# EAGLE schematic LaserBoardv1.0 (EAGLE 9.1.3)
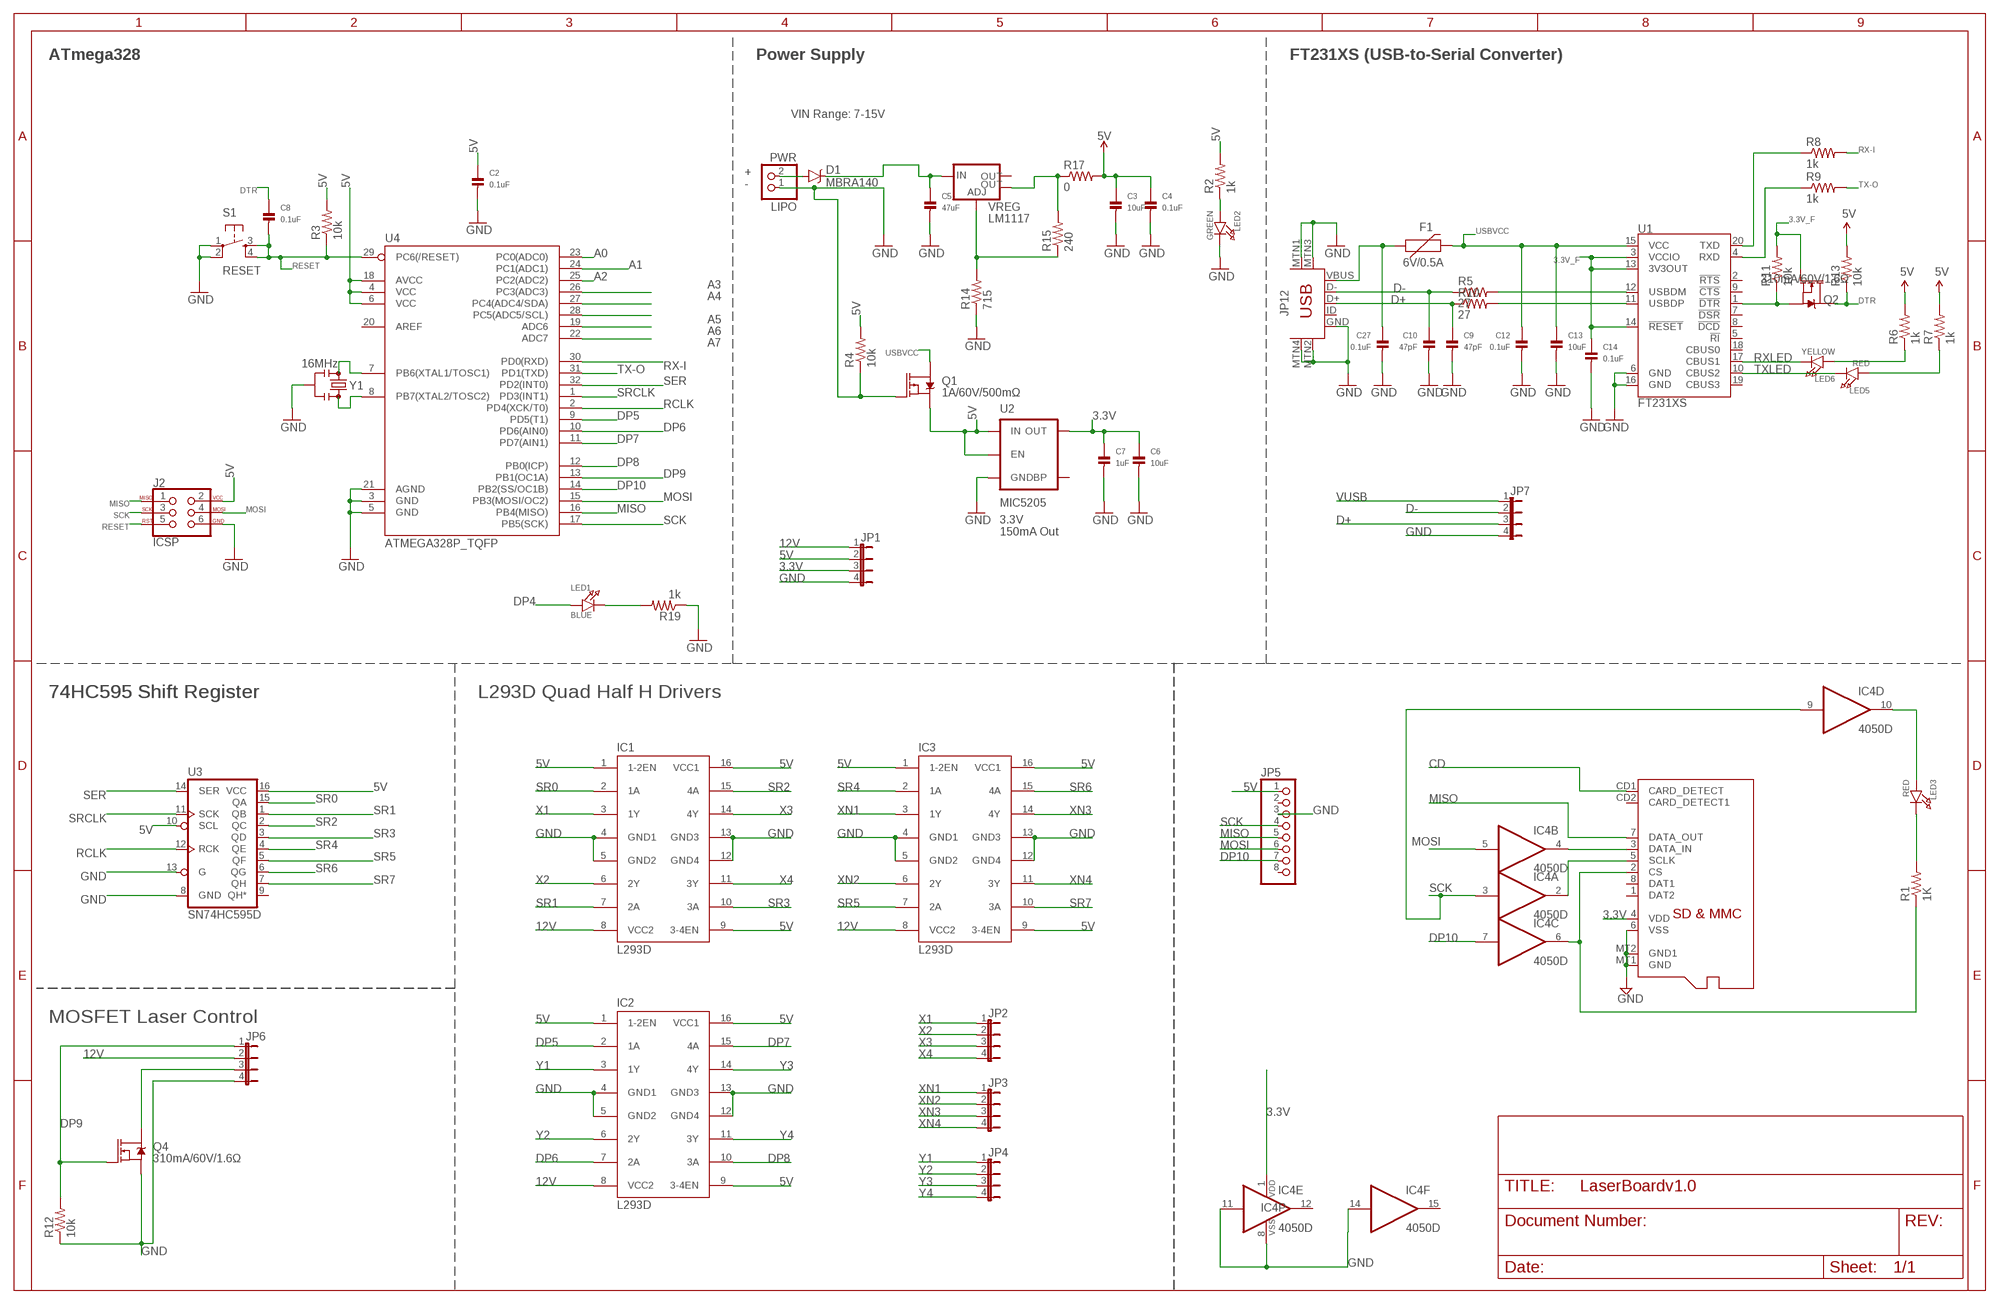
[diagram p0: schematic, sheet 1]

## Parts
C2  0.1uF  CAP_CERAMIC0805  [0805]
C3  10uF  CAP_CERAMIC0805  [0805]
C4  0.1uF  CAP_CERAMIC0805  [0805]
C5  47uF  CAP_CERAMIC0805  [0805]
C6  10uF  CAP_CERAMIC0805  [0805]
C7  1uF  CAP_CERAMIC0805  [0805]
C8  0.1uF  CAP_CERAMIC0805  [0805]
C9  47pF  CAP_CERAMIC0805  [0805]
C10  47pF  CAP_CERAMIC0805  [0805]
C12  0.1uF  CAP_CERAMIC0805  [0805]
C13  10uF  CAP_CERAMIC0805  [0805]
C14  0.1uF  CAP_CERAMIC0805  [0805]
C27  0.1uF  CAP_CERAMIC0805  [0805]
D1  MBRA140  [SMA-DIODE]
F1  6V/0.5A  PTC-HALF_AMP  [1206]
IC1  L293D  [DIL16]
IC2  L293D  [DIL16]
IC3  L293D  [DIL16]
IC4  4050D  [SO16]
J2  ICSP  AVR_SPI_PROG_3X2PTH  [2X3]
JP1  JP4E  [JP4]
JP2  JP4E  [JP4]
JP3  JP4E  [JP4]
JP4  JP4E  [JP4]
JP5  PINHD-1X8BIG  [1X08-BIG]
JP6  JP4E  [JP4]
JP7  JP4E  [JP4]
JP12  USB-MINIB-5PIN  [USB-MINIB]
LED1  BLUE  LED0805  [CHIPLED_0805]
LED2  GREEN  LED0805  [CHIPLED_0805]
LED3  RED  LED0805  [CHIPLED_0805]
LED5  RED  LED0805  [CHIPLED_0805]
LED6  YELLOW  LED0805  [CHIPLED_0805]
PWR  LIPO  JST_2PIN-THM-RA  [JST-PH-2-THM-RA]
Q1  1A/60V/500mΩ  MOSFET-PCH-ZXMP6A13F  [SOT23-3]
Q2  310mA/60V/1.6Ω  MOSFET-NCH-2N7002PW  [SOT323]
Q4  310mA/60V/1.6Ω  MOSFET-NCH-2N7002PW  [SOT323]
R1  1K  R-US_R0805  [R0805]
R2  1k  R-US_R0805  [R0805]
R3  10k  R-US_R0805  [R0805]
R4  10k  R-US_R0805  [R0805]
R5  27  R-US_R0805  [R0805]
R6  1k  R-US_R0805  [R0805]
R7  1k  R-US_R0805  [R0805]
R8  1k  R-US_R0805  [R0805]
R9  1k  R-US_R0805  [R0805]
R10  27  R-US_R0805  [R0805]
R11  10k  R-US_R0805  [R0805]
R12  10k  R-US_R0805  [R0805]
R13  10k  R-US_R0805  [R0805]
R14  715  R-US_R0805  [R0805]
R15  240  R-US_R0805  [R0805]
R17  0  R-US_R0805  [R0805]
R19  1k  R-US_R0805  [R0805]
S1  RESET  SWITCH_SPST_4_PINRECT  [TACTILE_SWITCH_SMD_4.6X2.8MM]
U1  FT231XS  [SSOP20_L]
U2  MIC5205  MIC52053.3V  [SOT23-5]
U3  SN74HC595D  74HC595D  [SO16]
U4  ATMEGA328P_TQFP  [TQFP32-08]
VREG  LM1117  V_REG_LM1117SOT223  [SOT223]
X1  MICROSD  [MICROSD]
Y1  16MHz  RESONATOR-16MHZSMD_3.2X1.3  [RESONATOR-SMD-3.2X1.3]

## Nets
3.3V: C6.1 C7.1 IC4.1(P:VDD) JP1.3 U2.5(OUT) X1.4(VDD)
3.3V_F: C14.1 Q2.1(G) R11.2 U1.3(VCCIO) U1.13(3V3OUT) U1.14(!RESET)
5V: C2.1 C3.1 C4.1 IC1.1(1-2EN) IC1.9(3-4EN) IC1.16(VCC1) IC2.1(1-2EN) IC2.9(3-4EN) IC2.16(VCC1) IC3.1(1-2EN) IC3.9(3-4EN) IC3.16(VCC1) J2.2 JP1.2 JP5.1 Q1.2(S) R2.2 R3.2 R4.2 R6.2 R7.2 R13.2 R17.2 U2.1(IN) U2.3(EN) U3.10(SCL) U3.16(VCC) U4.4(VCC) U4.6(VCC) U4.18(AVCC)
12V: C5.1 D1.C IC1.8(VCC2) IC2.8(VCC2) IC3.8(VCC2) JP1.1 JP6.2 VREG.3(IN)
A0: U4.23(PC0(ADC0))
A1: U4.24(PC1(ADC1))
A2: U4.25(PC2(ADC2))
A4: U4.27(PC4(ADC4/SDA))
A5: U4.28(PC5(ADC5/SCL))
CD: X1.CD1(CARD_DETECT)
D+: C9.1 JP7.3 JP12.D+ R10.1
D-: C10.1 JP7.2 JP12.D- R5.1
DP4: LED1.A
DP5: IC2.2(1A) U4.9(PD5(T1))
DP6: IC2.7(2A) U4.10(PD6(AIN0))
DP7: IC2.15(4A) U4.11(PD7(AIN1))
DP8: IC2.10(3A) U4.12(PB0(ICP))
DP9: JP6.1 Q4.1(G) R12.2 U4.13(PB1(OC1A))
DP10: IC4.7(C:I) JP5.7 U4.14(PB2(SS/OC1B))
DTR: C8.1 Q2.3(D) R13.1
FTDI_DTR: Q2.2(S) R11.1 U1.1(!DTR)
GND: C2.2 C3.2 C4.2 C5.2 C6.2 C7.2 C9.2 C10.2 C12.2 C13.2 C14.2 C27.2 IC1.4(GND1) IC1.5(GND2) IC1.12(GND4) IC1.13(GND3) IC2.4(GND1) IC2.5(GND2) IC2.12(GND4) IC2.13(GND3) IC3.4(GND1) IC3.5(GND2) IC3.12(GND4) IC3.13(GND3) IC4.8(P:VSS) IC4.11(E:I) IC4.14(F:I) J2.6 JP1.4 JP5.3 JP6.4 JP7.4 JP12.GND JP12.MTN1(MTN2) JP12.MTN2(MTN3) JP12.MTN3(MTN1) JP12.MTN4 LED2.C PWR.1 Q1.1(G) Q4.2(S) R4.1 R12.1 R14.1 R19.1 S1.1 S1.2 U1.6(GND) U1.16(GND) U2.2(GND) U3.8(GND) U3.13(G) U4.3(GND) U4.5(GND) U4.21(AGND) X1.6(VSS) X1.MT1(GND) X1.MT2(GND1) Y1.2
MISO: J2.1 JP5.5 U4.16(PB4(MISO)) X1.7(DATA_OUT)
MOSI: IC4.5(B:I) J2.4 JP5.6 U4.15(PB3(MOSI/OC2))
N$1: IC4.10(D:O) LED3.A
N$2: LED2.A R2.1
N$3: U4.7(PB6(XTAL1/TOSC1)) Y1.1
N$4: U4.8(PB7(XTAL2/TOSC2)) Y1.3
N$5: IC4.2(A:O) X1.5(SCLK)
N$6: R5.2 U1.12(USBDM)
N$7: R10.2 U1.11(USBDP)
N$8: LED5.A R7.1
N$9: IC4.6(C:O) R1.1 X1.2(CS)
N$10: LED6.A R6.1
N$11: LED3.C R1.2
N$12: IC4.4(B:O) X1.3(DATA_IN)
N$13: D1.A PWR.2
N$14: JP6.3 Q4.3(D)
N$15: R14.2 R15.1 VREG.1(ADJ)
N$21: U4.26(PC3(ADC3))
N$26: U4.19(ADC6)
N$27: U4.22(ADC7)
N$29: LED1.C R19.2
N$30: R15.2 R17.1 VREG.4(OUT)
RCLK: U3.12(RCK) U4.2(PD4(XCK/T0))
RESET: C8.2 J2.5 R3.1 S1.3 S1.4 U4.29(PC6(/RESET))
RX-I: R8.2 U4.30(PD0(RXD))
RXD: R9.1 U1.4(RXD)
RXLED: LED6.C U1.17(CBUS1)
SCK: IC4.3(A:I) IC4.9(D:I) J2.3 JP5.4 U4.17(PB5(SCK))
SER: U3.14(SER) U4.32(PD2(INT0))
SR0: IC1.2(1A) U3.15(QA)
SR1: IC1.7(2A) U3.1(QB)
SR2: IC1.15(4A) U3.2(QC)
SR3: IC1.10(3A) U3.3(QD)
SR4: IC3.2(1A) U3.4(QE)
SR5: IC3.7(2A) U3.5(QF)
SR6: IC3.15(4A) U3.6(QG)
SR7: IC3.10(3A) U3.7(QH)
SRCLK: U3.11(SCK) U4.1(PD3(INT1))
TX-O: R9.2 U4.31(PD1(TXD))
TXD: R8.1 U1.20(TXD)
TXLED: LED5.C U1.10(CBUS2)
USBVCC: C12.1 C13.1 F1.2 Q1.3(D) U1.15(VCC)
VUSB: C27.1 F1.1 JP7.1 JP12.VBUS
X1: IC1.3(1Y) JP2.1
X2: IC1.6(2Y) JP2.2
X3: IC1.14(4Y) JP2.3
X4: IC1.11(3Y) JP2.4
XN1: IC3.3(1Y) JP3.1
XN2: IC3.6(2Y) JP3.2
XN3: IC3.14(4Y) JP3.3
XN4: IC3.11(3Y) JP3.4
Y1: IC2.3(1Y) JP4.1
Y2: IC2.6(2Y) JP4.2
Y3: IC2.14(4Y) JP4.3
Y4: IC2.11(3Y) JP4.4
Unconnected: IC4.12(E:O) IC4.15(F:O) JP5.2 JP5.8 JP12.ID U1.2(!RTS) U1.5(!RI) U1.7(!DSR) U1.8(!DCD) U1.9(!CTS) U1.18(CBUS0) U1.19(CBUS3) U2.4(BP) U3.9(QH*) U4.20(AREF) VREG.2(OUT) X1.1(DAT2) X1.8(DAT1) X1.CD2(CARD_DETECT1)

## Notes on the sheet
- ATmega328 | Power Supply | FT231XS (USB-to-Serial Converter)
- VIN Range: 7-15V
- +
- -
- A3
- A4
- A5
- A6
- A7
- 3.3V
  150mA Out
- 74HC595 Shift Register | 74HC595 Shift Register | L293D Quad Half H Drivers
- MOSFET Laser Control

## Library data of the parts
C2-C10 C12-C14 C27 = microbuilder:CAP_CERAMIC: Ceramic Capacitors 0402 - 0402 Surface Mount Capacitors 16pF 50V 5% [Digikey: 445-4899-2-ND] 18pF 50V 5% [Digikey: 490-1281-2-ND] 22pF 50V 5% [Digikey: 490-1283-2-ND] 68pF 50V 5% [Digikey: 490-1289-2-ND] 0.1uF 10V 10% [Digikey: 490-1318-2-ND] 1.0uF 6.3V 10% [Digikey: 490-1320-2-ND] 0603 - 0603 Surface Mount Capacitors 16 pF 50V 5% [Digikey: 445-5051-2-ND] 22 pF 50V [Digikey: PCC220ACVTR-ND] 33 pF 50V 5% [Digikey: 490-1415-1-ND] 56pF 50V 5% [Digikey: 490-1421-1-ND] 220pF 50V 5% [Digikey: 445-1285-1-ND] 680 pF 50V 2200 pF 50V 5% C0G [Digikey: 445-1297-1-ND] 5600 pF 100V 5% X7R [Digikey: 478-3711-1-ND] 0.1 µF 25V 10% [Digikey: PCC2277TR-ND] 0.22 µF 16V 10% X7R [Digikey: 445-1318-1-ND] 1.0 µF 25V 10% [Digikey: 445-5146-2-ND] 0603 - RF Specific 3pF 250V +/-0.1pF RF [Digikey: 712-1347-1-ND] 18 pF 250V 5% [Digikey: 478-3505-1-ND or 712-1322-1-ND] 56 pF 250V 5% C0G RF [Digikey: 490-4867-1-ND] 68 pF 250V RF [Digikey: 490-4868-1-ND] 0805 - 0805 Surface Mount Capacitors 220 pF 250V 2% RF Ceramic Capacitor [Digikey: 712-1398-1-ND] 1000 pF 50V 2% NP0 Ceramic Capacitor [Digikey: 478-3760-1-ND] 0.1 µF 25V 10% Ceramic Capacitor [Digikey: PCC1828TR-ND] 1.0 µF 16V 10% Ceramic Capacitor[Digikey: 490-1691-2-ND] 10.0 µF 10V 10% Ceramic Capacitor[Digikey: 709-1228-1-ND] 10.0 uF 16V 10% Ceramic Capacitor [Digikey: 478-5165-2-ND] 47 uF 6.3V 20% Ceramic Capacitor [Digikey: 587-1779-1-ND or 399-5506-1-ND] 1206 - 1206 Surface Mount Capacitors 47uF 10V 20% Ceramic Capacitor [Digikey: 490-5528-1-ND or 399-5508-1-ND or 445-6010-1-ND] 100uF 6.3V -20%, +80% Y5V Ceramic Capacitor (Digikey: 490-4512-1-ND, Mouser: 81-GRM31CF50J107ZE1L)
D1 = SparkFun-DiscreteSemi:MBRA140: 40V, 1A Schottky rectifier SMA/DO-214AC package DIO-08053; PROD_ID: DIO-08053
F1 = SparkFun-Fuses:PTC: Resettable Fuse PTC Resettable Fuse. Really a resistor with a postive temperature coefficient who's resistance increases dramatically with an increase in temperature. When heated by the power passing through the resistance rises causing the current to be limited, protecting the circuit. When a PTC cools back down it resumes conducting letting the circuit turn back on.; PROD_ID: RES-08585
IC1-IC3 = L293D:L293D: PUSH-PULL 4 CHANNEL DRIVER; AVAILABILITY: Good; DESCRIPTION: Driver; 36V; Power DIP; 600mA Low LevelO/P; 1.2A O/P High Level; 4 Drivers; 7V; MF: STMicroelectronics; MP: L293D; PACKAGE: SOIC-20 STMicroelectronics; PRICE: 2.45 USD
IC4 = 40xx:4050: Hex non-inverting BUFFER
J2 = SparkFun-Connectors:AVR_SPI_PROG_3X2: AVR ISP 6 Pin This is the reduced ISP connector for AVR programming. Common on Arduino. This footprint will take up less PCB space and can be used with a 10-pin to 6-pin adapter such as SKU: BOB-08508 **Special note about "TEST_POINT" package. The stop mask is on the top side, so if you want your programming test points to be on the bottom of your board, make sure to place this package on the bottom side of the board. This also ensure that the orientation to program from the bottom side will be correct. SparkFun Products: SparkFun ISP Pogo Adapter <https://www.sparkfun.com/products/11591> - NS Tiny AVR Programmer <https://www.sparkfun.com/products/11801> -PTH
JP1-JP4 JP6 JP7 = jumper:JP4E: JUMPER
JP5 = adafruit:PINHD-1X8: PIN HEADER
JP12 = SparkFun-Connectors:USB-MINIB: Mini-USB "B" connector with 5th pin broken out. Created new symbol breaking out 5th "ID" pin in mini/micro USB connector spec. See: http://en.wikipedia.org/wiki/Mini_usb#Cables. Uses same footprint as 4-pin symbol. Also added pins to connect to mounting / shield pads if required (probably not generally needed as signals aren't shielded once they leave the connector).; PROD_ID: CONN-08193
LED1-LED3 LED5 LED6 = microbuilder:LED: LED 0603 - 0603 Surface Mount Package 2mA: Green LED - Low Power (3.9mcd, 2ma, 1.7Vf) - Digikey: 475-2709-2-ND Orange LED - Low Power (9.8mcd, 2ma, 1.8Vf) - Digikey: 475-1194-2-ND Red LED - Low Power (5mcd, 2ma, 1.8Vf) - Digikey: 475-1195-2-ND Yellow LED - Low Power (7mcd, 2ma, 1.8Vf) - Digikey: 475-1196-2-ND 5mA: Blue LED - Low Power (17mcd, 5ma, 2.9Vf) - Digikey: LNJ937W8CRACT-ND 0805 - 0805 Surface Mount Package 2mA: Red LED (8.8mcd, 2mA, 1.8Vf, Clear) - Low Power [Digikey: 475-2510-1-ND] Green LED (5mcd, 2mA, 1.8Vf, Clear) - Low Power [Digikey: 475-2730-1-ND] Yellow LED (11.3mcd, 2mA, 1.8Vf, Clear) - Low Power [Digikey: 475-2555-1-ND] 20mA: Red LED (104mcd, 20mA, Diffused) - LS R976 [Digikey: 475-1278-6-ND] Red LED (12mcd, 20mA, 2.0Vf, Clear) - APT2012EC [Digikey: 754-1128-1-ND] Green LED (15mcd, 20mA, 2.2Vf, Clear) - APT2012GC [Digikey: 754-1131-1-ND] Orange LED (160mcd, 20mA, 2.1Vf, Clear) - APT2012SECK [Digikey: 754-1130-1-ND] 1206 - 1206 Surface Mount Package Green LED (26mcd, 20mA, Diffused) - LG N971 [Digikey: 475-1407-6-ND] Red LED (15mcd, 20mA, Diffused) - LH N974 [Digikey: 475-1416-6-ND]
PWR = adafruit:JST_2PIN: JST 2-Pin Connectors of various flavors SMT-RA (S2B-PH-SM4) 4UConnector #17311 SMT (B2B-PH-SM4) THM-RA (S2B-PH) THM (B2B-PH)
Q1 = SparkFun-DiscreteSemi:MOSFET-PCH: P-channel MOSFETs Voltage controlled devices that allow control of high current outputs.; PROD_ID: TRANS-08285
Q2 Q4 = SparkFun-DiscreteSemi:MOSFET-NCH: N-channel MOSFETs Voltage controlled devices that allow control of high current outputs. SparkFun Products: SparkFun OpenScale <https://www.sparkfun.com/products/13261> SparkFun Digital Sandbox <https://www.sparkfun.com/products/12651> SparkFun Monster Moto Shield <https://www.sparkfun.com/products/10182> SparkFun MOSFET Power Controller <https://www.sparkfun.com/products/11214>; PROD_ID: TRANS-11151
R1-R15 R17 R19 = adafruit:R-US_: RESISTOR, American symbol
S1 = SparkFun-Electromechanical:SWITCH_SPST_4_PIN; PROD_ID: SWCH-13065
U1 = SparkFun-IC-Comms:FT231X: FTDI FT231X Full Speed USB to Full-handshake UART This USB2.0 Full Speed IC offers a compact bridge to full handshake UART interfaces. The device is a UART, capable of operating up to 3MBaud, with low power consumption (8mA). The FT231X includes the complete FT-X series feature set and enables USB to be added into a system design quickly and easily over a UART interface. Datasheet <http://cdn.sparkfun.com/datasheets/Components/General%20IC/DS_FT231X.pdf> SparkFun Products SparkFun RedBoard - Programmed with Arduino <https://www.sparkfun.com/products/12757> (DEV-12757) SparkFun XBee Explorer USB <https://www.sparkfun.com/products/11812> (WRL-11812) SparkFun XBee Explorer Dongle <https://www.sparkfun.com/products/11697> (WRL-11697) SparkFun Blynk Board - ESP8266 <https://www.sparkfun.com/products/13794> (WRL-13794) SparkFun ESP8266 Thing - Dev Board <https://www.sparkfun.com/products/13711> (WRL-13711) SparkFun Block for Intel® Edison - Base <https://www.sparkfun.com/products/13045> (DEV-13045) SparkFun RedStick <https://www.sparkfun.com/products/13741> (DEV-13741) SparkFun Beefy 3 - FTDI Basic Breakout <https://www.sparkfun.com/products/13746> (DEV-13746) SparkFun FT231X Breakout <https://www.sparkfun.com/products/11736> (BOB-11736); PROD_ID: IC-11524
U2 = SparkFun-PowerIC:MIC5205: MIC5205 150mA vreg 3.3V - VREG-00822 5V - VREG-00823; PROD_ID: VREG-00822
U3 = SparkFun-IC-Logic:74*595: 8-Bit Shift Register (Serial to Parallel) Datasheet <http://cdn.sparkfun.com/datasheets/BreakoutBoards/MM74HC595.pdf> SparkFun Products SparkFun Shift Register Breakout - 74HC595 <https://www.sparkfun.com/products/10680> (BOB-10680); PROD_ID: IC-07875
U4 = SparkFun-IC-Microcontroller:ATMEGA328P_TQFP; PROD_ID: IC-09069
VREG = SparkFun-IC-Power:V_REG_LM1117: Voltage Regulator LM1117 Standard adjustable voltage regulator but in SMD form. Spark Fun Electronics SKU : COM-00595; PROD_ID: VREG-08170
X1 = adafruit:MICROSD: Micro-SD / Transflash card holder with SPI pinout For the 3M # 2908-05WB-MG and/or 4UCON #19656 push-push type
Y1 = SparkFun-Clocks:RESONATOR-16MHZ: 16MHz Resonator Digikey Example <http://www.digikey.com/product-detail/en/murata-electronics-north-america/CSTCE16M0V53-R0/490-1198-1-ND/584635> Frequency: 16MHz Frequency Stability: ±0.3% Frequency Tolerance: ±0.5% Capacitance: 15pF; PROD_ID: XTAL-08900

## Net classes
0 default: width 0.152 mm, drill 0.305 mm, clearance 0.152 mm